# Altium schematic sheet 1_1_P1.schdoc.schdoc
size 441 x 322 mm; Symbol: Altium_Custom(1700*1220); Device: Altium_Custom(1700*1220); Company: 嘉立创EDA; Version: V1.0; Page Size: A4; @Project Name: oran; @Page Count: 1; @Update Date: 2024-04-16; @Create Date: 2024-04-06; @Schematic Name: 1_P1; @Page No: 1; @Page Name: 1_P1
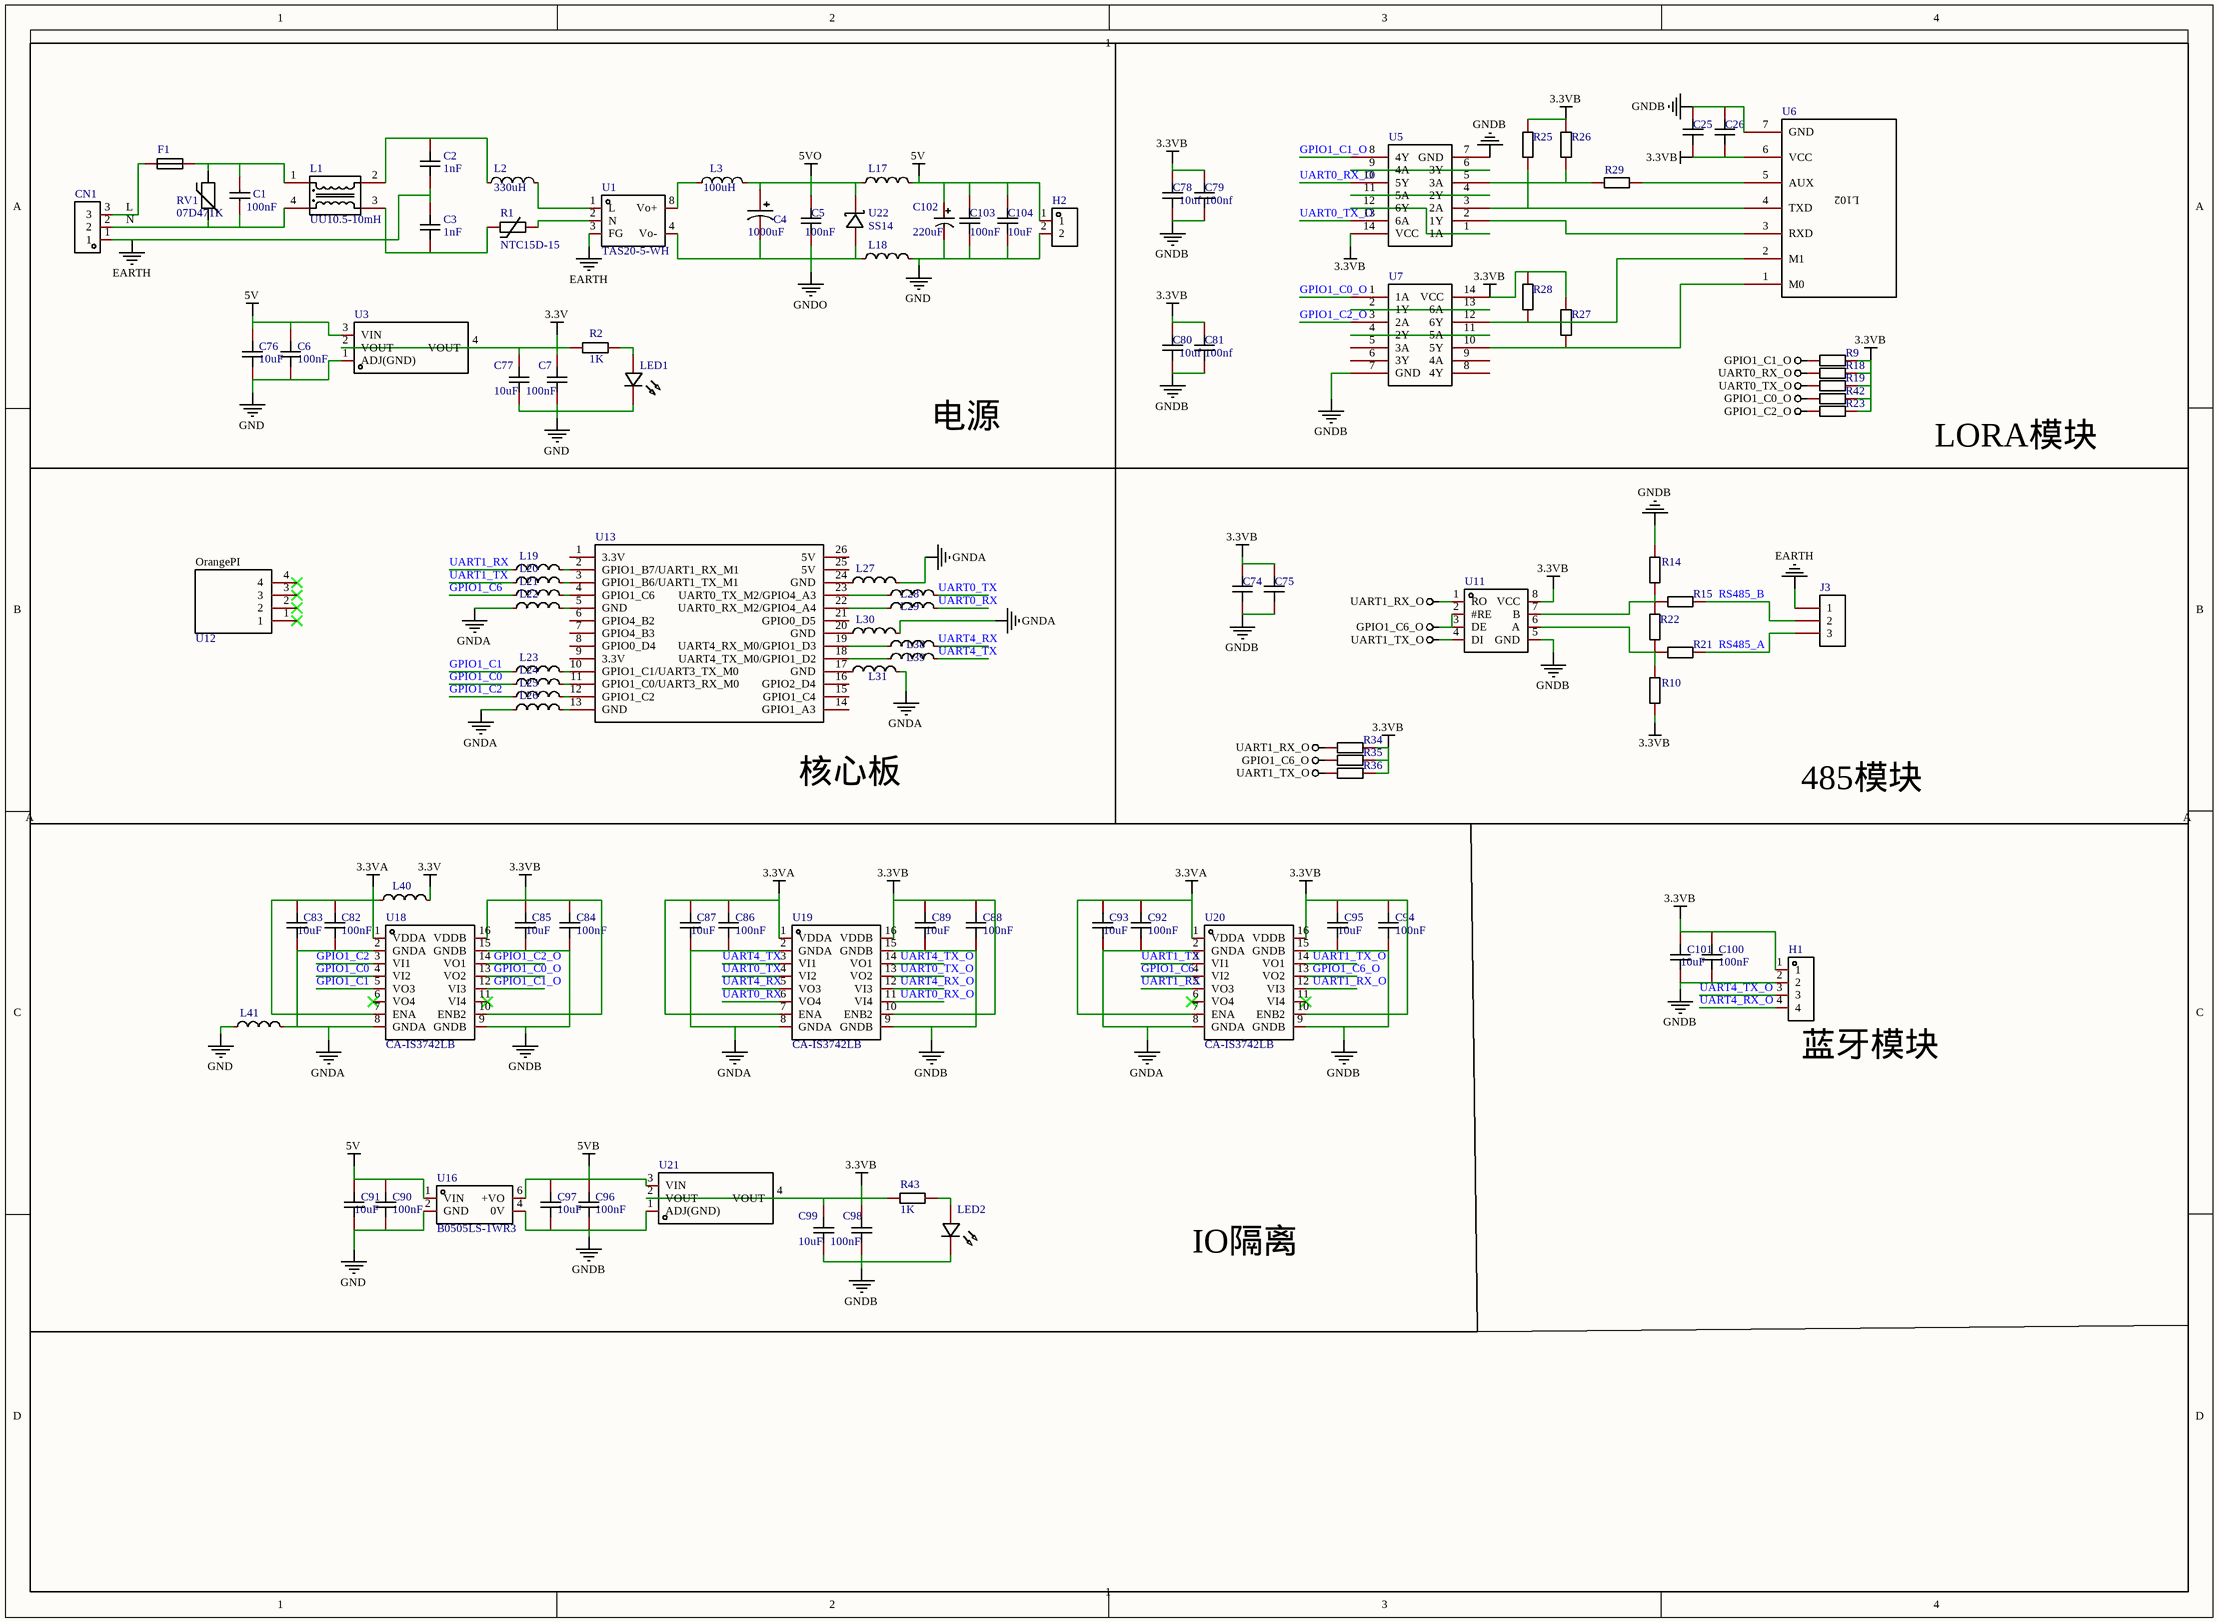
[diagram p0: 1_1_P1.schdoc.schdoc]

## Parts
C1  100nF  [CAP-TH_L18.0-W6.0-P15.00-D1.2]
C2  1nF  [CAP-TH_L8.5-W5.0-P10.00-D0.6]
C3  1nF  [CAP-TH_L8.5-W5.0-P10.00-D0.6]
C4  1000uF  [CAP-TH_BD10.0-P5.00-D1.0-FD]
C5  100nF  [C0603]
C6  100nF  [C0603]
C7  100nF  [C0603]
C25  10uf  [C0805_2]  (value not drawn)
C26  100nf  [C0603]  (value not drawn)
C74  10uf  [C0805]  (value not drawn)
C75  100nf  [C0603]  (value not drawn)
C76  10uF  [C0805]
C77  10uF  [C0805]
C78  10uf  [C0805]
C79  100nf  [C0603]
C80  10uf  [C0805]
C81  100nf  [C0603]
C82  100nF  [C0603]
C83  10uF  [C0805]
C84  100nF  [C0603]
C85  10uF  [C0805]
C86  100nF  [C0603]
C87  10uF  [C0805]
C88  100nF  [C0603]
C89  10uF  [C0805]
C90  100nF  [C0603]
C91  10uF  [C0805]
C92  100nF  [C0603]
C93  10uF  [C0805]
C94  100nF  [C0603]
C95  10uF  [C0805]
C96  100nF  [C0603]
C97  10uF  [C0805]
C98  100nF  [C0603]
C99  10uF  [C0805]
C100  100nF  [C0603]
C101  10uF  [C0805]
C102  220uF  [CAP-TH_BD8.0-P3.50-D0.6-FD]
C103  100nF  [C0603]
C104  10uF  [C0805]
CN1  KF2EDGRC-7.5-3P  [CONN-TH_KF2EDGRC-7.5-3P]  (value not drawn)
F1  2010T1A250V  [FUSE-TH_L8.5-W4.0-P5.08-D0.6]  (value not drawn)
H1  2.54-1*4P母  [HDR-TH_4P-P2.54-V-F]  (value not drawn)
H2  PZ254V-11-02P  [HDR-TH_2P-P2.54-V-M]  (value not drawn)
J3  15EDG-3P  [15EDG3.81-WI-3P]  (value not drawn)
L1  UU10.5-10mH  [FILTER-TH_4P-L19.5-W18.0-P10.00-D0.7-S13.00]
L2  330uH  [IND-TH_BD9.0-P5.00-D0.7]
L3  100uH  [IND-TH_BD7.0-P2.50-D0.7]
L17  BLM31PG330SN1L  [L1206]  (value not drawn)
L18  BLM31PG330SN1L  [L1206]  (value not drawn)
L19  BLM31PG330SN1L  [L1206]  (value not drawn)
L20  BLM31PG330SN1L  [L1206]  (value not drawn)
L21  BLM31PG330SN1L  [L1206]  (value not drawn)
L22  BLM31PG330SN1L  [L1206]  (value not drawn)
L23  BLM31PG330SN1L  [L1206]  (value not drawn)
L24  BLM31PG330SN1L  [L1206]  (value not drawn)
L25  BLM31PG330SN1L  [L1206]  (value not drawn)
L26  BLM31PG330SN1L  [L1206]  (value not drawn)
L27  BLM31PG330SN1L  [L1206]  (value not drawn)
L28  BLM31PG330SN1L  [L1206]  (value not drawn)
L29  BLM31PG330SN1L  [L1206]  (value not drawn)
L30  BLM31PG330SN1L  [L1206]  (value not drawn)
L31  BLM31PG330SN1L  [L1206]  (value not drawn)
L38  BLM31PG330SN1L  [L1206]  (value not drawn)
L39  BLM31PG330SN1L  [L1206]  (value not drawn)
L40  BLM31PG330SN1L  [L1206]  (value not drawn)
L41  BLM31PG330SN1L  [L1206]  (value not drawn)
LED1  LED_0603-R  [LED_0603]  (value not drawn)
LED2  LED_0603-R  [LED_0603]  (value not drawn)
R1  NTC15D-15  [RES-TH_L17.5-W6.0-P10.0-S5.0-D0.8]
R2  1K  [R0603]
R9  10K  [C0603]  (value not drawn)
R10  3.3K  [C0603]  (value not drawn)
R14  3.3K  [C0603]  (value not drawn)
R15  10R  [C0603]  (value not drawn)
R18  10K  [C0603]  (value not drawn)
R19  10K  [C0603]  (value not drawn)
R21  10R  [C0603]  (value not drawn)
R22  27K  [C0603]  (value not drawn)
R23  10K  [C0603]  (value not drawn)
R25  10K  [C0603]  (value not drawn)
R26  10K  [C0603]  (value not drawn)
R27  10K  [C0603]  (value not drawn)
R28  10K  [C0603]  (value not drawn)
R29  100R  [C0603]  (value not drawn)
R34  10K  [C0603]  (value not drawn)
R35  10K  [C0603]  (value not drawn)
R36  10K  [C0603]  (value not drawn)
R42  10K  [C0603]  (value not drawn)
R43  1K  [R0603]
RV1  07D471K  [RES-TH_L9.0-W5.0-P6.00-D0.7-S3.00]
U1  TAS20-5-WH  [PWRM-TH_TAS20-XX-WH]
U3  AMS1117-3.3  [SOT-223-3_L6.5-W3.4-P2.30-LS7.0-BR]  (value not drawn)
U5  74HC14M/TR  [SOIC-14]  (value not drawn)
U6  WH-L102-L  [WH-L102-L_Lib_V1.0]  (value not drawn)
U7  74HC14M/TR  [SOIC-14]  (value not drawn)
U11  SP3485EEN  [SOP-8_L5.0-W4.0-P1.27-LS6.0-BL]  (value not drawn)
U12  Orangepi  [orangePI]  (value not drawn)
U13  26Pin芯片引脚  [IDC-TH_X9555WV-2X13-PTV]  (value not drawn)
U16  B0505LS-1WR3  [PWRM-TH_BXXXXLS-1WR3]
U18  CA-IS3742LB  [SSOP-16_L4.9-W3.9-P0.64-LS6.0-BL]
U19  CA-IS3742LB  [SSOP-16_L4.9-W3.9-P0.64-LS6.0-BL]
U20  CA-IS3742LB  [SSOP-16_L4.9-W3.9-P0.64-LS6.0-BL]
U21  AMS1117-3.3  [SOT-223-3_L6.5-W3.4-P2.30-LS7.0-BR]  (value not drawn)
U22  SS14  [SOD-323_L1.7-W1.3-LS2.5-RD]

## Nets
3.3V: C7.2 C77.2 L40.2 R2.1 U3.2(VOUT) U3.4(VOUT)
3.3VA: C82.2 C83.2 C86.2 C87.2 C92.2 C93.2 L40.1 U18.1(VDDA) U18.7(ENA) U19.1(VDDA) U19.7(ENA) U20.1(VDDA) U20.7(ENA)
3.3VB: C25.2 C26.2 C74.1 C75.1 C78.1 C79.1 C80.1 C81.1 C84.2 C85.2 C88.2 C89.2 C94.2 C95.2 C98.2 C99.2 C100.2 C101.2 H1.1 R9.1 R10.2 R18.1 R19.1 R23.1 R25.2 R26.2 R27.2 R28.2 R34.1 R35.1 R36.1 R42.1 R43.1 U5.14(VCC) U6.6(VCC) U7.14(VCC) U11.8(VCC) U18.10(ENB2) U18.16(VDDB) U19.10(ENB2) U19.16(VDDB) U20.10(ENB2) U20.16(VDDB) U21.2(VOUT) U21.4(VOUT)
5V: C6.1 C76.1 C90.2 C91.2 C102.1 C103.2 C104.2 H2.1 L17.2 U3.3(VIN) U16.1(VIN)
5VB: C96.2 C97.2 U16.6(+VO) U21.3(VIN)
5VO: C4.1 C5.2 L3.2 L17.1 U22.1(K)
EARTH: C2.2 C3.1 CN1.1 J3.1 U1.3(FG)
GND: C6.2 C7.1 C76.2 C77.1 C90.1 C91.1 C102.2 C103.1 C104.1 H2.2 L18.2 L41.1 LED1.1(C) U3.1(ADJ(GND)) U16.2(GND)
GNDA: C82.1 C83.1 C86.1 C87.1 C92.1 C93.1 L22.1 L26.1 L27.2 L30.2 L31.2 L41.2 U18.2(GNDA) U18.8(GNDA) U19.2(GNDA) U19.8(GNDA) U20.2(GNDA) U20.8(GNDA)
GNDB: C25.1 C26.1 C74.2 C75.2 C78.2 C79.2 C80.2 C81.2 C84.1 C85.1 C88.1 C89.1 C94.1 C95.1 C96.1 C97.1 C98.1 C99.1 C100.1 C101.1 H1.2 LED2.1(C) R14.1 U5.7(GND) U6.7(GND) U7.7(GND) U11.5(GND) U16.4(0V) U18.9(GNDB) U18.15(GNDB) U19.9(GNDB) U19.15(GNDB) U20.9(GNDB) U20.15(GNDB) U21.1(ADJ(GND))
GNDO: C4.2 C5.1 L18.1 U1.4(Vo-) U22.2(A)
GPIO1_C0_O: R42.2 U7.1(1A) U18.13(VO2)
GPIO1_C1_O: R9.2 U5.8(4Y) U18.12(VI3)
GPIO1_C2_O: R23.2 U7.3(2A) U18.14(VO1)
GPIO1_C6_O: R35.2 U11.2(#RE) U11.3(DE) U20.13(VO2)
UART0_RX_O: R18.2 U5.10(5Y) U19.11(VI4)
UART0_TX_O: R19.2 U5.13(6A) U19.13(VO2)
UART1_RX_O: R34.2 U11.1(RO) U20.12(VI3)
UART1_TX_O: R36.2 U11.4(DI) U20.14(VO1)
GPIO1_C0: L24.1 U18.4(VI2)
GPIO1_C1: L23.1 U18.5(VO3)
GPIO1_C2: L25.1 U18.3(VI1)
GPIO1_C6: L21.1 U20.4(VI2)
RS485_A: J3.3 R21.1
RS485_B: J3.2 R15.1
UART0_RX: L29.2 U19.6(VO4)
UART0_TX: L28.2 U19.4(VI2)
UART1_RX: L19.1 U20.5(VO3)
UART1_TX: L20.1 U20.3(VI1)
UART4_RX: L38.2 U19.5(VO3)
UART4_RX_O: H1.4 U19.12(VI3)
UART4_TX: L39.2 U19.3(VI1)
UART4_TX_O: H1.3 U19.14(VO1)
NetC1_1: C1.1 CN1.2 L1.4 RV1.2
NetC1_2: C1.2 F1.2 L1.1 RV1.1
NetC2_1: C2.1 L1.2 L2.1
NetC3_2: C3.2 L1.3 R1.1
NetCN1_3: CN1.3 F1.1
NetL2_2: L2.2 U1.1(L)
NetL3_1: L3.1 U1.8(Vo+)
NetL19_2: L19.2 U13.2(GPIO1_B7/UART1_RX_M1)
NetL20_2: L20.2 U13.3(GPIO1_B6/UART1_TX_M1)
NetL21_2: L21.2 U13.4(GPIO1_C6)
NetL22_2: L22.2 U13.5(GND)
NetL23_2: L23.2 U13.10(GPIO1_C1/UART3_TX_M0)
NetL24_2: L24.2 U13.11(GPIO1_C0/UART3_RX_M0)
NetL25_2: L25.2 U13.12(GPIO1_C2)
NetL26_2: L26.2 U13.13(GND)
NetL27_1: L27.1 U13.24(GND)
NetL28_1: L28.1 U13.23(UART0_TX_M2/GPIO4_A3)
NetL29_1: L29.1 U13.22(UART0_RX_M2/GPIO4_A4)
NetL30_1: L30.1 U13.20(GND)
NetL31_1: L31.1 U13.17(GND)
NetL38_1: L38.1 U13.19(UART4_RX_M0/GPIO1_D3)
NetL39_1: L39.1 U13.18(UART4_TX_M0/GPIO1_D2)
NetLED1_2: LED1.2(A) R2.2
NetLED2_2: LED2.2(A) R43.2
NetR1_2: R1.2 U1.2(N)
NetR10_1: R10.1 R21.2 R22.1 U11.6(A)
NetR14_2: R14.2 R15.2 R22.2 U11.7(B)
NetR25_1: R25.1 U5.3(2A) U6.4(TXD)
NetR26_1: R26.1 R29.2 U5.5(3A)
NetR27_1: R27.1 U6.1(M0) U7.10(5Y)
NetR28_1: R28.1 U6.2(M1) U7.12(6Y)
NetR29_1: R29.1 U6.5(AUX)
NetU5_1: U5.1(1A) U5.12(6Y)
NetU5_2: U5.2(1Y) U6.3(RXD)
NetU5_4: U5.4(2Y) U5.11(5A)
NetU5_6: U5.6(3Y) U5.9(4A)
NetU7_2: U7.2(1Y) U7.13(6A)
NetU7_4: U7.4(2Y) U7.11(5A)

Not connected (* = marked no-connect by the designer): U7 5(3A) 6(3Y) 8(4Y) 9(4A); U12 1* 2* 3* 4*; U13 1(3.3V) 6(GPIO4_B2) 7(GPIO4_B3) 8(GPIO0_D4) 9(3.3V) 14(GPIO1_A3) 15(GPIO1_C4) 16(GPIO2_D4) 21(GPIO0_D5) 25(5V) 26(5V); U18 6(VO4)* 11(VI4)*; U20 6(VO4)* 11(VI4)*

## Notes on the sheet
- (near CN1) L
- (near CN1) N
- 电源
- LORA模块
- (near U13) 核心板
- 485模块
- (near H1) 蓝牙模块
- IO隔离
- 1
- A
- (in symbol Orangepi) OrangePI
- (in symbol WH-L102-L) L102

## Library data of the parts
C1 = 100nF: Manufacturer: SRD(圣融达); Symbol: MP2104K27D2X8LC; Add into BOM: yes; Tolerance: ±10%; Voltage(AC): 275V; Subclass: X2; safety certification: UL；ENEC；VDE；CQC；CSA; Name: 100nF; Device: 100nF; Supplier: LCSC; Manufacturer Part: MP2104K27D2X8LC; Value: 100nF; Supplier Part: C105762; JLCPCB Part Class: 扩展库; LCSC Part Name: 100nF ±10% 275V 等级:X2; Supplier Footprint: 插件,P=15mm; Datasheet: https://atta.szlcsc.com/upload/public/pdf/source/20211112/28AD7BCA5F9A6D19E46F5213448E69C0.pdf; Convert to PCB: yes; Origin Footprint: CAP-TH_L18.0-W6.0-P15.00-D1.2; Design Item ID: MP2104K27D2X8LC
C2 C3 = 1nF: Manufacturer: HEL(鸿志); Symbol: Y15F1D102ML; Add into BOM: yes; Tolerance: ±20%; Voltage(AC): 400V; Subclass: Y1; Name: 1nF; Device: 1nF; LCSC Part Name: 等级:Y1 1nF ±20% 400V; Supplier Part: C332367; Manufacturer Part: Y15F1D102ML; Supplier Footprint: 插件,P=10mm; JLCPCB Part Class: 扩展库; Datasheet: https://atta.szlcsc.com/upload/public/pdf/source/20181130/C332372_EA8D2B597A88A824E44325E038B9D018.pdf; Supplier: LCSC; Convert to PCB: yes; Value: 1nF; Origin Footprint: CAP-TH_L8.5-W5.0-P10.00-D0.6; Design Item ID: Y15F1D102ML
C4 = 1000uF: Manufacturer: KNSCHA(科尼盛); Symbol: 01EC4294SHC1000UF25V; Add into BOM: yes; Tolerance: ±20%; Rated Voltage: 25V; Ripple Current: 450mA@120Hz; φD: 10mm; L: 16mm; Lifetime @ Temp: 5000hrs@105℃; Name: 1000uF; Device: 1000uF; LCSC Part Name: 1000uF ±20% 25V; Supplier Part: C503217; Manufacturer Part: 01EC4294SHC1000UF25V; Supplier Footprint: 插件,D10xL16mm; JLCPCB Part Class: 扩展库; Datasheet: https://atta.szlcsc.com/upload/public/pdf/source/20200324/C503217_05464B9B8F3E25C695CF18DE02B15AC9.pdf; Supplier: LCSC; Convert to PCB: yes; Value: 1000uF; Equivalent Series Resistance(ESR): -; Lead Spacing: 5mm; Origin Footprint: CAP-TH_BD10.0-P5.00-D1.0-FD; Design Item ID: 01EC4294SHC1000UF25V
C5-C7 C98 = 100nF: Symbol: CAP_0603; Convert to PCB: yes; Name: 100nF; Device: 100nF; Add into BOM: yes; Supplier Footprint: 0603; Value: 100nF; Origin Footprint: C0603; Design Item ID: CAP_0603
C25 C74 C78 C80 = 10uf: 贴片瓷片电容; Origin Footprint 2: 0805; Origin Footprint 3: 1206; Origin Footprint 4: 0603; Origin Footprint 5: 5.08F; Origin Footprint 6: 10.0F; Origin Footprint 7: 0603-C; Add into BOM: yes; Origin Footprint 1: 0805-C; Name: 10uf; Symbol: 10uf; Device: 10uf; Published: 8-Jun-2000; LatestRevisionDate: 17-Jul-2002; LatestRevisionNote: Re-released for DXP Platform.; PackageReference: RAD-0.3; Publisher: Altium Limited; value: 10uf; Convert to PCB: yes; Design Item ID: Cap-S; Library Name: jay_schlib
C26 C75 C79 C81 = 100nf: 贴片瓷片电容; Origin Footprint 2: 0805; Origin Footprint 3: 1206; Origin Footprint 4: 0603; Origin Footprint 5: 5.08F; Origin Footprint 6: 10.0F; Add into BOM: yes; Origin Footprint 1: 0603-C; Name: 100nf; Symbol: 100nf; Device: 100nf; Published: 8-Jun-2000; LatestRevisionDate: 17-Jul-2002; LatestRevisionNote: Re-released for DXP Platform.; PackageReference: RAD-0.3; Publisher: Altium Limited; value: 100nf; Convert to PCB: yes; Design Item ID: Cap-S; Library Name: jay_schlib
C76 C77 C99 = 10uF: Symbol: CAP_0805; Convert to PCB: yes; Name: 10uF; Device: 10uF; Add into BOM: yes; Supplier Footprint: 0805; Value: 10uF; Origin Footprint: C0805; Design Item ID: CAP_0805
C82 C84 C86 C88 C90 C92 C94 C96 C100 C103 = CAP_0603: Symbol: CapAcitance; Convert to PCB: yes; Name: 100nF; Device: CAP_0603; Add into BOM: yes; Supplier Footprint: 0603; Value: 100nF
C83 C85 C87 C89 C91 C93 C95 C97 C101 C104 = CAP_0805: Symbol: CapAcitance; Convert to PCB: yes; Name: 10uF; Device: CAP_0805; Add into BOM: yes; Supplier Footprint: 0805; Value: 10uF
C102 = ERS1VM221F12OT: Manufacturer: AISHI(艾华集团); Add into BOM: yes; Tolerance: ±20%; Rated Voltage: 35V; φD: 8mm; L: 12mm; Lifetime @ Temp: 7000hrs@105℃; Description: 容值:220uF;精度:±20%;额定电压:35V;; Name: 220uF; Symbol: ERS1VM221F12OT; Device: ERS1VM221F12OT; LCSC Part Name: 220uF ±20% 35V; Supplier Part: C106697; Manufacturer Part: ERS1VM221F12OT; Supplier Footprint: 插件,D8xL12mm; JLCPCB Part Class: 扩展库; Datasheet: https://atta.szlcsc.com/upload/public/pdf/source/20191015/C438940_4B8E60A742BB0AE40DDEF87A5C89089D.pdf; Supplier: LCSC; Convert to PCB: yes; Value: 220uF; Lead Spacing: 3.5mm
CN1 = KF2EDGRC-7.5-3P: Manufacturer: KEFA(科发); Add into BOM: yes; Connector Type: 板端/插座-闭口; Structure: 1x3P; Pitch: 7.5mm; Number of PINs Per Row: 3; Current Rating (Max): 15A; Voltage Rating (Max): 400V; Name: KF2EDGRC-7.5-3P; Symbol: KF2EDGRC-7.5-3P; Device: KF2EDGRC-7.5-3P; Supplier: LCSC; Supplier Part: C976441; Manufacturer Part: KF2EDGRC-7.5-3P; JLCPCB Part Class: 扩展库; LCSC Part Name: 7.5mm 1x3P 排数:1 每排P数:3; Supplier Footprint: 弯插,P=7.5mm; Datasheet: https://atta.szlcsc.com/upload/public/pdf/source/20191023/C441253_65F21A9FF58C4C3FC0086078C71B8A16.pdf; Convert to PCB: yes; Color: 绿色; Mounting Style: 弯针; Number of Pins: 3P; Number of Rows: 1; Operating Temperature Range: -40℃~+105℃; Origin Footprint: CONN-TH_KF2EDGRC-7.5-3P; Design Item ID: KF2EDGRC-7.5-3P
F1 = 2010T1A250V: Manufacturer: WALTER(华德); Add into BOM: yes; Current Rating: 1A; Name: 2010T1A250V; Symbol: 2010T1A250V; Device: 2010T1A250V; Supplier: LCSC; Supplier Part: C354900; Manufacturer Part: 2010T1A250V; JLCPCB Part Class: 扩展库; LCSC Part Name: 插件式保险丝; Supplier Footprint: 插件; Datasheet: https://atta.szlcsc.com/upload/public/pdf/source/20181226/C354908_56D0A636A97884A85D4A44B7DA5ABF9D.pdf; Convert to PCB: yes; Type: -; Origin Footprint: FUSE-TH_L8.5-W4.0-P5.08-D0.6; Design Item ID: 2010T1A250V
H1 = 2.54-1*4P母: Manufacturer: BOOMELE(博穆精密); Add into BOM: yes; Holes Structure: 1x4P; Pitch: 2.54mm; Circular Hole / Square Hole: 方孔; Number of Holes: 4P; Current Rating (Max): 3A; Holes Direction: 顶部; Description: 插孔结构:1x4P;间距:2.54mm;行距:-;圆孔/方孔:方孔;安装类型:直插;排数:单排;总孔位数:4P;额定电流:3A;额定电压:-;插孔方向:顶部;塑高:-;触头材质:青铜;触头镀层:-;工作温度范围:-40℃~+105℃;焊接温度(最大值):-;; Name: 2.54-1*4P母; Symbol: 2.54-1*4P母; Device: 2.54-1*4P母; Supplier: LCSC; Supplier Part: C2718488; Manufacturer Part: 2.54-1*4P母; JLCPCB Part Class: 扩展库; LCSC Part Name: 间距:2.54mm 1x4P 直插; Supplier Footprint: 插件,P=2.54mm; Datasheet: https://atta.szlcsc.com/upload/public/pdf/source/20210301/C2718488_F4427B881E42CAA8DDB0B1C12B3A522C.pdf; Convert to PCB: yes; Row Spacing: -; Mounting Type: 直插; Number of Rows: 单排; Voltage Rating (Max): -; Insulation Height: -; Contact Material: 青铜; Contact Plating: -; Operating Temperature Range: -40℃~+105℃; Soldering Temperature(Max): -
H2 = PZ254V-11-02P: Manufacturer: XFCN(兴飞); Add into BOM: yes; Pin Structure: 1x2P; Pitch: 2.54mm; Circluar Pins/Square Pins: 方针; Description: 插针结构:1x2P;间距:2.54mm;行距:-;圆针/方针:方针;安装类型:直插;排数:单排;总PIN位数:2P;额定电流:-;额定电压:-;配合针长度:6mm;塑高:2.5mm;端接针长度:3mm;触头材质:黄铜;触头镀层:-;工作温度范围:-40℃~+105℃;颜色:黑色;; Name: PZ254V-11-02P; Symbol: PZ254V-11-02P; Device: PZ254V-11-02P; Supplier: LCSC; Supplier Part: C492401; Manufacturer Part: PZ254V-11-02P; JLCPCB Part Class: 扩展库; LCSC Part Name: 间距:2.54mm 1x2P 直插 方针; Supplier Footprint: 插件,P=2.54mm; Datasheet: https://atta.szlcsc.com/upload/public/pdf/source/20200309/C492401_A812433581A9B211A7FFA413ADDFF0E5.pdf; Convert to PCB: yes; Row Spacing: -; Mounting Type: 直插; Number of Rows: 单排; Number of Pins: 2P; Current Rating (Max): -; Voltage Rating (Max): -; Length of Mating Pin: 6mm; Insulation Height: 2.5mm; Length of End Connection Pin: 3mm; Contact Material: 黄铜; Contact Plating: -; Operating Temperature Range: -40℃~+105℃; Color: 黑色
J3 = 15EDG-3P: 接插件; Origin Footprint 2: HDR3X1_A; Origin Footprint 3: JS3_3.96; Origin Footprint 4: JS3_5.08; Origin Footprint 5: KF2EDGVM-5.08-3P; Origin Footprint 6: KF2EDGK-2.54-WI-3P; Add into BOM: yes; Name: 15EDG-3P; Symbol: 15EDG-3P; Device: 15EDG-3P; LatestRevisionDate: 17-Jul-2002; LatestRevisionNote: Re-released for DXP Platform.; Publisher: Altium Limited; Convert to PCB: yes; Origin Footprint 1: 15EDG3.81-WI-3P; Design Item ID: Header 3; Library Name: jay_schlib
L1 = UU10.5-10mH: Manufacturer: FH(风华); Add into BOM: yes; Number of Lines: 2; Withstanding Voltage: 125V; Inductance @ Frequency: 10mH@1kHz; DC Resistance (DCR): 1.5Ω; Name: UU10.5-10mH; Symbol: UU10.5-10mH; Device: UU10.5-10mH; LCSC Part Name: 两路 插件共模滤波器; Supplier Part: C191661; Manufacturer Part: UU10.5-10mH; Supplier Footprint: 插件; JLCPCB Part Class: 扩展库; Datasheet: https://atta.szlcsc.com/upload/public/pdf/source/20180614/C191661_E47EE6B7EFF2A044B730E48FD270800E.pdf; Supplier: LCSC; Convert to PCB: yes; Origin Footprint: FILTER-TH_4P-L19.5-W18.0-P10.00-D0.7-S13.00; Design Item ID: UU10.5-10mH
L2 = 330uH: Manufacturer: SXN(顺翔诺); Symbol: PK0810-331MB; Add into BOM: yes; Tolerance: ±20%; Rated Current: 500mA; DC Resistance (DCR): 470mΩ; Type: 工字电感; Name: 330uH; Device: 330uH; Supplier: LCSC; Supplier Part: C400318; Manufacturer Part: PK0810-331MB; Value: 330uH; JLCPCB Part Class: 扩展库; LCSC Part Name: 330uH ±20%; Supplier Footprint: 插件; Datasheet: https://atta.szlcsc.com/upload/public/pdf/source/20210810/BA6D1DA7D4BCBB7C641BC97B42CFC6FF.pdf; Convert to PCB: yes; Origin Footprint: IND-TH_BD9.0-P5.00-D0.7; Design Item ID: PK0810-331MB
L3 = 100uH: Manufacturer: SXN(顺翔诺); Symbol: PK0608-101MB; Add into BOM: yes; Tolerance: ±20%; Rated Current: 650mA; DC Resistance (DCR): 350mΩ; Type: 工字电感; Name: 100uH; Device: 100uH; Supplier: LCSC; Supplier Part: C400302; Manufacturer Part: PK0608-101MB; Value: 100uH; JLCPCB Part Class: 扩展库; LCSC Part Name: 100uH ±20%; Supplier Footprint: 插件; Datasheet: https://atta.szlcsc.com/upload/public/pdf/source/20210810/BA6D1DA7D4BCBB7C641BC97B42CFC6FF.pdf; Convert to PCB: yes; Origin Footprint: IND-TH_BD7.0-P2.50-D0.7; Design Item ID: PK0608-101MB
L17-L31 L38-L41 = BLM31PG330SN1L: Manufacturer: muRata(村田); Add into BOM: yes; Impedance @ Frequency: 33Ω@100MHz; Tolerance: ±25%; DC Resistance: 9mΩ; Current Rating: 6A; Circuits: 1; Name: BLM31PG330SN1L; Symbol: BLM31PG330SN1L; Device: BLM31PG330SN1L; LCSC Part Name: 单路 1206磁珠 阻抗33Ω@100MHz; Supplier Part: C74090; Manufacturer Part: BLM31PG330SN1L; Supplier Footprint: 1206; JLCPCB Part Class: 扩展库; Datasheet: https://atta.szlcsc.com/upload/public/pdf/source/20180326/C88997_FE7208E239BA92CF7577D85CF2703D30.pdf; Supplier: LCSC; Convert to PCB: yes; Origin Footprint: L1206; Design Item ID: BLM31PG330SN1L
LED1 LED2 = LED_0603-R: Convert to PCB: yes; Name: LED_0603-R; Symbol: LED_0603-R; Device: LED_0603-R; Add into BOM: yes; Supplier Footprint: 0603; Origin Footprint: LED_0603; Design Item ID: LED_0603-R
R1 = NTC15D-15: Manufacturer: RUILON(瑞隆源); Add into BOM: yes; Resistance @ 25℃: 15Ω; B Constant (25℃/50℃): 2950K; Resistance Tolerance: ±20%; Power: 3.5W; B Constant Tolerance: ±10%; Steady State Current (Max): 4A; Name: NTC15D-15; Symbol: NTC15D-15; Device: NTC15D-15; LCSC Part Name: 15Ω 电阻精度:±20% 2950K; Supplier Part: C2935580; Manufacturer Part: NTC15D-15; Supplier Footprint: 插件,P=7.5mm; JLCPCB Part Class: 扩展库; Datasheet: https://atta.szlcsc.com/upload/public/pdf/source/20240318/E1BAD4F825DF907E5FFBE2B334DE71B4.pdf; Supplier: LCSC; Convert to PCB: yes; B Constant (25℃/75℃): 2950K; B Constant (25℃/85℃): 2950K; B Constant (25℃/100℃): 2950K; Operating Temperature: -40℃~+200℃; Origin Footprint: RES-TH_L17.5-W6.0-P10.0-S5.0-D0.8; Design Item ID: NTC15D-15
R2 R43 = 1K: Symbol: Res_0603; Convert to PCB: yes; Name: 1K; Device: 1K; Add into BOM: yes; Supplier Footprint: 0603; Value: 1K; Origin Footprint: R0603; Design Item ID: Res_0603
R9 R18 R19 R23 R25-R28 R42 = 10K: 贴片电阻; Value: 2.2K; Origin Footprint 2: 0805; Origin Footprint 3: 1206; Origin Footprint 4: 0603; Origin Footprint 5: 5.08F; Add into BOM: yes; Origin Footprint 1: 0603-R; Name: 10K; Symbol: 10K; Device: 10K; Published: 8-Jun-2000; LatestRevisionDate: 17-Jul-2002; LatestRevisionNote: Re-released for DXP Platform.; PackageReference: AXIAL-0.4; Publisher: Altium Limited; Convert to PCB: yes; Design Item ID: Res1; Library Name: jay_schlib
R10 R14 = 3.3K: Resistor; Origin Footprint 2: 0603; Origin Footprint 3: 0603-C; Add into BOM: yes; Origin Footprint 1: 0603-R; Name: 3.3K; Symbol: 3.3K; Device: 3.3K; Published: 8-Jun-2000; LatestRevisionDate: 17-Jul-2002; LatestRevisionNote: Re-released for DXP Platform.; PackageReference: AXIAL-0.4; Publisher: Altium Limited; Value: 3.3K; Convert to PCB: yes; Design Item ID: Res2; Library Name: *
R15 R21 = 10R: Resistor; Origin Footprint 2: 0603; Origin Footprint 3: 0603-C; Add into BOM: yes; Origin Footprint 1: 0603-R; Name: 10R; Symbol: 10R; Device: 10R; Published: 8-Jun-2000; LatestRevisionDate: 17-Jul-2002; LatestRevisionNote: Re-released for DXP Platform.; PackageReference: AXIAL-0.4; Publisher: Altium Limited; Value: 10R; Convert to PCB: yes; Design Item ID: Res2; Library Name: *
R22 = 27K: Resistor; Value: 24K; Origin Footprint 2: 0603; Origin Footprint 3: 0603-C; Add into BOM: yes; Origin Footprint 1: 0603-R; Name: 27K; Symbol: 27K; Device: 27K; Published: 8-Jun-2000; LatestRevisionDate: 17-Jul-2002; LatestRevisionNote: Re-released for DXP Platform.; PackageReference: AXIAL-0.4; Publisher: Altium Limited; Convert to PCB: yes; Design Item ID: Res2; Library Name: *
R29 = 100R: 贴片电阻; Value: 2.2K; Origin Footprint 2: 0805; Origin Footprint 3: 1206; Origin Footprint 4: 0603; Origin Footprint 5: 5.08F; Add into BOM: yes; Origin Footprint 1: 0603-R; Name: 100R; Symbol: 100R; Device: 100R; Published: 8-Jun-2000; LatestRevisionDate: 17-Jul-2002; LatestRevisionNote: Re-released for DXP Platform.; PackageReference: AXIAL-0.4; Publisher: Altium Limited; Convert to PCB: yes; Design Item ID: Res1; Library Name: jay_schlib
R34-R36 = 10K: 贴片电阻; Origin Footprint 2: 0805; Origin Footprint 3: 1206; Origin Footprint 4: 0603; Origin Footprint 5: 5.08F; Add into BOM: yes; Origin Footprint 1: 0603-R; Name: 10K; Symbol: 10K; Device: 10K; Published: 8-Jun-2000; LatestRevisionDate: 17-Jul-2002; LatestRevisionNote: Re-released for DXP Platform.; PackageReference: AXIAL-0.4; Publisher: Altium Limited; Value: 10K; Convert to PCB: yes; Design Item ID: Res1; Library Name: jay_schlib
RV1 = 07D471K: Manufacturer: COV(德欣); Add into BOM: yes; Varistor Voltage: 423V~517V; Clamping Voltage: 810V; Allowable Voltage (DC): 385V; Allowable Voltage (AC): 300V; Peak Current: 1.2kA; Maximum Energy: 29J; Typical Capatitance: 105pF@1kHz; Name: 07D471K; Symbol: 07D471K; Device: 07D471K; LCSC Part Name: 钳位电压810V 29焦耳 插件压敏电阻; Supplier Part: C317765; Manufacturer Part: 07D471K; Supplier Footprint: 插件; JLCPCB Part Class: 扩展库; Datasheet: https://atta.szlcsc.com/upload/public/pdf/source/20201014/C317616_901970575376E76045DDED0C068F8E0D.pdf; Supplier: LCSC; Convert to PCB: yes; Origin Footprint: RES-TH_L9.0-W5.0-P6.00-D0.7-S3.00; Design Item ID: 07D471K
U1 = TAS20-5-WH: Manufacturer: TDPOWER(腾达电源); Add into BOM: yes; Conversion Type: AC-DC；AC/DC-DC; Input Voltage(DC): 100V~370V; Output Voltage: 5V; Output Power: 20W; Input Voltage(AC): 85VAC~265VAC; Output Current (Max): 4A; Function: 降压型; Isolation or not: 隔离; Output Channel: 1; Insulated Voltage: 2.5kV@AC; Conversion Efficiency: 85%; Name: TAS20-5-WH; Symbol: TAS20-5-WH; Device: TAS20-5-WH; Supplier: LCSC; Supplier Part: C570980; Manufacturer Part: TAS20-5-WH; JLCPCB Part Class: 扩展库; LCSC Part Name: TAS20-5-WH; Supplier Footprint: 插件,45x62mm; Datasheet: https://atta.szlcsc.com/upload/public/pdf/source/20200629/C570976_BABBC0A38CBFE4D0C33423D864EC8C09.pdf; Convert to PCB: yes; Feature: 过流保护；短路保护自恢复; Origin Footprint: PWRM-TH_TAS20-XX-WH; Design Item ID: TAS20-5-WH
U3 U21 = AMS1117-3.3: Manufacturer: YONGYUTAI(永裕泰); Add into BOM: yes; Output Type: 固定; Maximum Input Voltage: 18V; Output Voltage: 3.3V; MAX Output Current: 1A; Power Supply Rejection Ratio (PSRR): 60dB@(120Hz); Dropout Voltage: 1.3V@(1A); standby current: 5mA; Noise: 0.005%Vout; Output Polarity: 正极; Number of Outputs: 1; Name: AMS1117-3.3; Symbol: AMS1117-3.3; Device: AMS1117-3.3; Supplier: LCSC; Supplier Part: C2891839; Manufacturer Part: AMS1117-3.3; JLCPCB Part Class: 扩展库; LCSC Part Name: 输入18V 输出3.3V 1A; Supplier Footprint: SOT-223-3; Datasheet: https://atta.szlcsc.com/upload/public/pdf/source/20210901/A75ADDE6A17DEE0002F2A58A8D1F3634.pdf; Convert to PCB: yes; Feature: -; Operating Temperature: -40℃~+125℃@(Tj); Origin Footprint: SOT-223-3_L6.5-W3.4-P2.30-LS7.0-BR; Design Item ID: AMS1117-3.3
U5 U7 = 74HC14M/TR: 反相器; Origin Footprint 2: SOIC-14W; Origin Footprint 3: TSSOP-14; Add into BOM: yes; Name: 74HC14M/TR; Symbol: 74HC14M/TR; Device: 74HC14M/TR; Convert to PCB: yes; Origin Footprint 1: SOIC-14; Design Item ID: 74HC14; Library Name: jay_schlib
U6 = WH-L102-L: Add into BOM: yes; Name: WH-L102-L; Symbol: WH-L102-L; Device: WH-L102-L; Convert to PCB: yes; Origin Footprint: WH-L102-L_Lib_V1.0; Design Item ID: WH-L102-L; Library Name: WH-L102-L_Lib_V1.0
U11 = SP3485EEN: Manufacturer: UMW(友台半导体); Add into BOM: yes; Types: 收发器; Supply Voltage: 2.97V~3.63V; Data Rate: 12Mbps; Driver/receiver: 1/1; Name: SP3485EEN; Symbol: SP3485EEN; Device: SP3485EEN; LCSC Part Name: SP3485EEN; Supplier Part: C668205; Manufacturer Part: SP3485EEN; Supplier Footprint: SOP-8; JLCPCB Part Class: 扩展库; Datasheet: https://atta.szlcsc.com/upload/public/pdf/source/20231109/A068A439CF0AE9265B075B2C5F4AA545.pdf; Supplier: LCSC; Convert to PCB: yes; Operating Temperature: -40℃~+85℃; Origin Footprint: SOP-8_L5.0-W4.0-P1.27-LS6.0-BL; Design Item ID: SP3485EEN
U12 = Orangepi: Add into BOM: yes; Name: Orangepi; Symbol: Orangepi; Device: Orangepi; Convert to PCB: yes; Origin Footprint: orangePI; Design Item ID: Orangepi
U13 = 26Pin芯片引脚: Add into BOM: yes; Name: 26Pin芯片引脚; Symbol: 26Pin芯片引脚; Device: 26Pin芯片引脚; Convert to PCB: yes; Origin Footprint: IDC-TH_X9555WV-2X13-PTV; Design Item ID: 26Pin芯片引脚
U16 = B0505LS-1WR3: Manufacturer: DEXU(德旭电子); Symbol: B0505LS-1WR3_C909800; Add into BOM: yes; Conversion Type: DC-DC; Input Voltage(DC): 4.5V~5.5V; Output Voltage: 5V; Output Current (Max): 200mA; Output Channel: 1; Description: 转换类型:DC-DC;输入电压(DC):4.5V~5.5V;输出电压:5V;输出电流(最大值):200mA;功能类型:-;; Name: B0505LS-1WR3; Device: B0505LS-1WR3; Supplier: LCSC; Supplier Part: C909800; Manufacturer Part: B0505LS-1WR3; JLCPCB Part Class: 扩展库; LCSC Part Name: B0505LS-1WR3; Supplier Footprint: 插件; Datasheet: https://atta.szlcsc.com/upload/public/pdf/source/20220506/97E51FF679E86FC18F266BBBBBA200F9.pdf; Convert to PCB: yes; Function: -
U18-U20 = CA-IS3742LB: Manufacturer: Chipanalog(川土微); Add into BOM: yes; Name: CA-IS3742LB; Symbol: CA-IS3742LB; Device: CA-IS3742LB; LCSC Part Name: CA-IS374x 高速四通道数字隔离器; Supplier Part: C7422512; Manufacturer Part: CA-IS3742LB; Supplier Footprint: SSOP16(B); Datasheet: https://atta.szlcsc.com/upload/public/pdf/source/20240402/A6B3DE0FE33F5A1BA9DC823DA65C6095.pdf; Supplier: LCSC; Convert to PCB: yes
U22 = SS14: Symbol: SS14_C9900017063; Add into BOM: yes; Name: SS14; Device: SS14; LCSC Part Name: SS14; Supplier Part: C9900017063; Manufacturer Part: SS14; Supplier Footprint: SOD-323; JLCPCB Part Class: 扩展库; Supplier: LCSC; Convert to PCB: yes